# EasyEDA Pro project ProDoc_917_control_board_B.epro, board SiWG917 Control Board_B
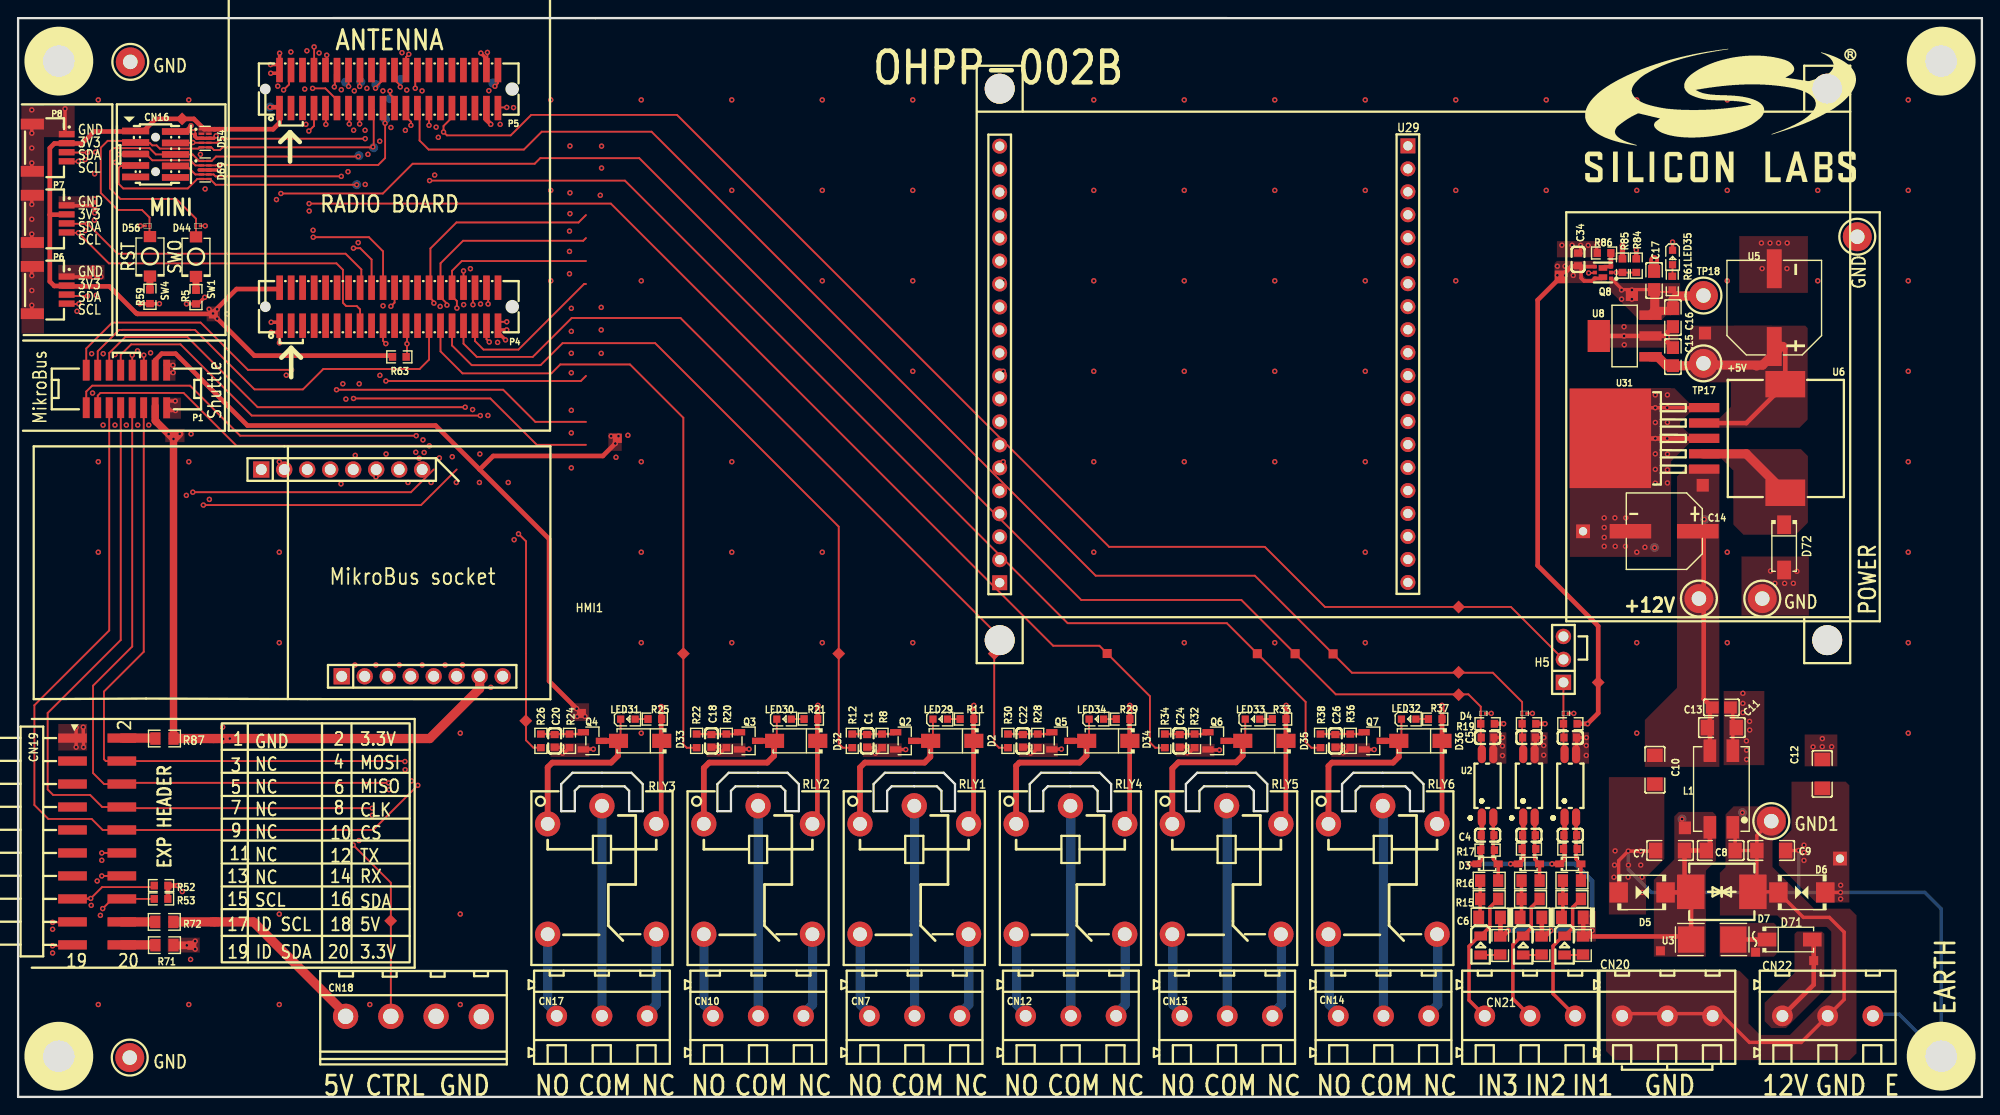
[diagram p8: board, top side]
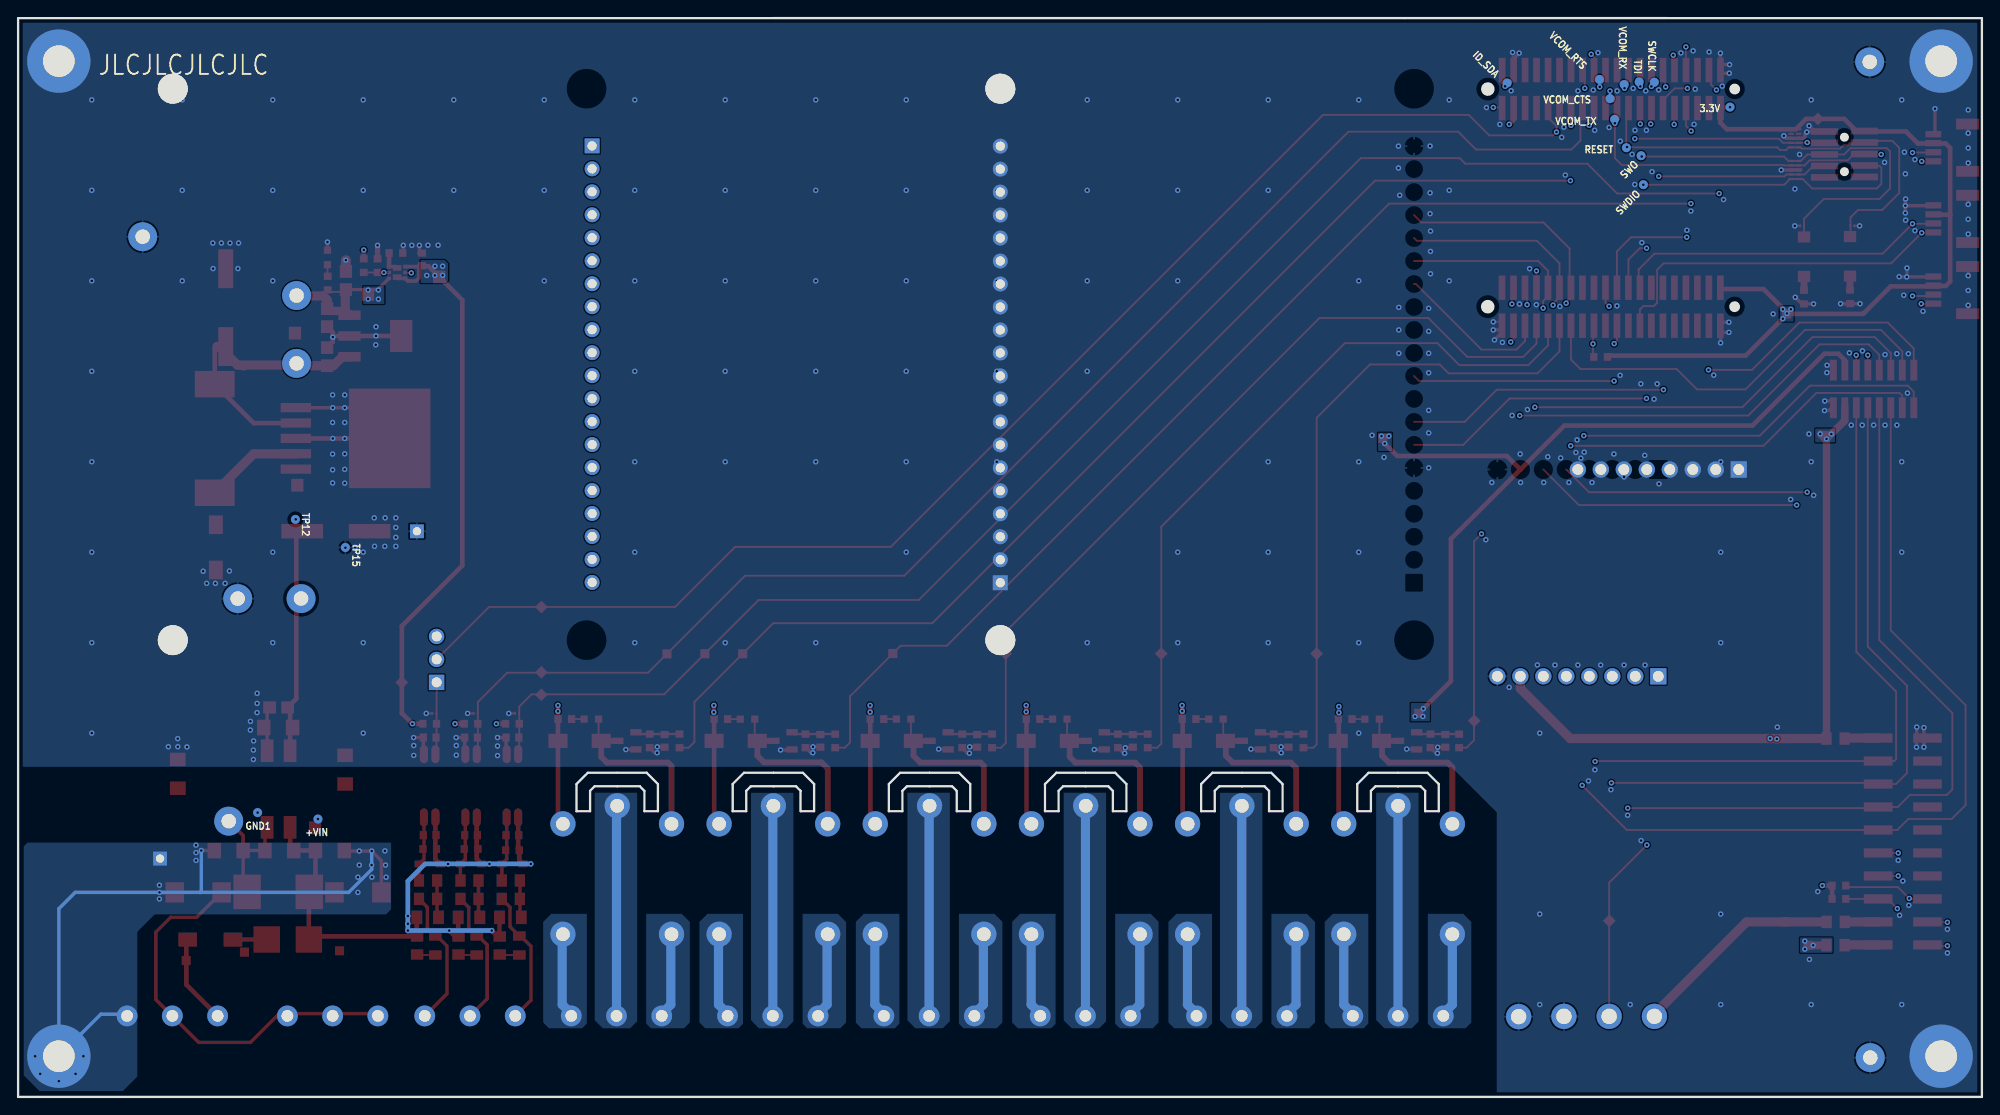
[diagram p9: board, bottom side, seen from below]

Outline 217 x 119.26 mm; copper layers: Top Layer, Inner1, Inner2, Bottom Layer. Coordinates in mm from the lower left corner of the outline.
Outline path: 0,119.25 63.82,119.26 217,119.25 217,0 0,0 0,119.25
Stack: Top Layer 0.035mm Outer layer thickness 1oz / Dielectric1 0.2104mm 7628 RC49% 8.6mil / Inner1 0.0152mm Inner layer thickness / Dielectric2 1.065mm 1.1mm H/HOZ Copper / Inner2 0.0152mm Inner layer thickness / Dielectric3 0.2104mm 7628 RC49% 8.6mil / Bottom Layer 0.035mm Outer layer thickness 1oz

## Design rules (mm)
template: Custom Config
spacing copperThickness1oz (default): track to track 0.203, other pairs 0.152 to 0.508
spacing Power: track to track 0.203, other pairs 0.102 to 0.305
spacing copperThicknessInner0.5oz: track to track 0.152, other pairs 0.152 to 0.3
track width Single50: min 0.356, default 0.356, max 0.356
track width SC50: min 0.203, default 0.203, max 0.203
track width AUTO (default): min 0.203, default 0.203, max 1.016
track width power: min 0.203, default 0.508, max 3.81
track width ForGND: min 0.203, default 0.381, max 1.27
differential pair differentialPair90 (default): width min 0.208, default 0.208, max 0.208; gap min 0.127, default 0.274
via viaSize (default): diameter min 0.599, default 0.599, max 0.599; hole min 0.3, default 0.3, max 0.3
net +3V3 uses Power, power
net GND uses ForGND, Power
net +12V_IN uses CR5V, Power, power
net PGND uses ForGND, Power
net +12DC_IN uses CR5V, Power, power
net +5V uses Power, power
net GND1 uses ForGND, Power
net +VIN uses Power, power
net +VIN1 uses Power, power
net +3V3_LDO uses Power, power
net $4N2550 uses CR5V

## Placement (name value [footprint] x y rotation side)
3.3V  -  [Test-Point-0.5mm]  27.83 109.42 270 bottom
+5V  -  [Test-Point-0.5mm]  192.1 80.79 0 top
+12V  RH-5120  [TESTPOINT-TH_BD3.2-D1.6-1]  185.73 55.09 270 top
+VIN  -  [Test-Point-0.5mm]  183.87 30.72 180 bottom
C1  1nF  [C0603]  93.82 39.36 90 top
C4  10nF  [C0603]  162.38 28.93 180 top
C5  100nF  [C0603]  162.38 39.73 180 top
C6  100nF  [CAP-SMD_L3.2-W1.6-FD]  162.6 19.84 180 top
C7  10nF  [C1206]  182.55 27.24 180 top
C8  10nF  [C1206]  188.13 27.24 180 top
C9  10nF  [C1206]  193.72 27.24 180 top
C10  10nF  [C1206]  180.87 36.17 270 top
C11  10nF  [C1206]  188.26 40.83 180 top
C12  10nF  [C1206]  199.36 35.71 90 top
C13  1uF  [C0805]  188.21 43.05 180 top
C14  100uF  [CAP-SMD_BD8.0-L8.3-W8.3-LS9.3-FD]  181.88 62.53 180 top
C15  22uF  [C0805]  182.86 81.83 270 top
C16  22uF  [C0805]  182.86 86.15 90 top
C17  22uF  [C0805]  180.78 90.25 270 top
C18  1nF  [C0603]  76.62 39.36 90 top
C20  1nF  [C0603]  59.29 39.36 90 top
C22  1nF  [C0603]  111.03 39.36 90 top
C24  1nF  [C0603]  128.36 39.36 90 top
C26  1nF  [C0603]  145.56 39.36 90 top
C28  10nF  [C0603]  166.95 28.93 180 top
C29  100nF  [C0603]  166.95 39.73 180 top
C30  100nF  [CAP-SMD_L3.2-W1.6-FD]  167.17 19.84 180 top
C31  10nF  [C0603]  171.52 28.93 180 top
C32  100nF  [C0603]  171.52 39.73 180 top
C33  100nF  [CAP-SMD_L3.2-W1.6-FD]  171.74 19.84 180 top
C34  1uF  [C0603]  172.37 92.58 270 top
CN7  WJ128V-5.0-3P  [CONN-TH_3P-P5.00_WJ128V-5.0-3P]  99.06 8.95 0 top
CN10  WJ128V-5.0-3P  [CONN-TH_3P-P5.00_WJ128V-5.0-3P]  81.79 8.95 0 top
CN12  WJ128V-5.0-3P  [CONN-TH_3P-P5.00_WJ128V-5.0-3P]  116.33 8.95 0 top
CN13  WJ128V-5.0-3P  [CONN-TH_3P-P5.00_WJ128V-5.0-3P]  133.6 8.95 0 top
CN14  WJ128V-5.0-3P  [CONN-TH_3P-P5.00_WJ128V-5.0-3P]  150.88 8.95 0 top
CN16  3132-10MG0BK00R2  [IDC-SMD_3132-10MG0BK00R2]  15.19 104.18 270 top
CN17  WJ128V-5.0-3P  [CONN-TH_3P-P5.00_WJ128V-5.0-3P]  64.52 8.95 0 top
CN18  WJ128V-5.0-4P  [CONN-TH_4P-P5.00_WJ128V-4P-5.0-14-00A]  43.69 8.89 0 top
CN19  PZ254-2-10-WS  [HDR-SMD_20P-P2.54-H-M-R2-C10_L8.5]  8.74 28.24 270 top
CN20  WJ128V-5.0-3P  [CONN-TH_3P-P5.00_WJ128V-5.0-3P]  182.25 8.95 0 top
CN21  WJ128V-5.0-3P  [CONN-TH_3P-P5.00_WJ128V-5.0-3P]  167.06 8.95 0 top
CN22  WJ128V-5.0-3P  [CONN-TH_3P-P5.00_WJ128V-5.0-3P]  199.96 8.95 0 top
D2  NRVA4007T3G  [SMA_L4.3-W2.6-LS5.2-FD]  103.22 39.36 0 top
D3  1N4148WS-7-F  [SOD-323_L1.8-W1.3-LS2.5-RD]  162.38 25.76 0 top
D4  TPD1E0B04DPLT  [X2SON-2_L0.6-W0.3-P0.35]  161.87 42.39 180 top
D5  SMBJ24CA-E3/5B  [SMB_L4.3-W3.6-LS5.4-BI]  179.45 22.61 180 top
D6  SMBJ24CA-E3/5B  [SMB_L4.3-W3.6-LS5.4-BI]  197.1 22.61 0 top
D7  SMCJ33CAHE3_A/H  [SMC_L6.9-W5.9-LS7.9-BI]  188.26 22.67 180 top
D32  NRVA4007T3G  [SMA_L4.3-W2.6-LS5.2-FD]  85.98 39.36 0 top
D33  NRVA4007T3G  [SMA_L4.3-W2.6-LS5.2-FD]  68.73 39.36 0 top
D34  NRVA4007T3G  [SMA_L4.3-W2.6-LS5.2-FD]  120.47 39.36 0 top
D35  NRVA4007T3G  [SMA_L4.3-W2.6-LS5.2-FD]  137.71 39.36 0 top
D36  NRVA4007T3G  [SMA_L4.3-W2.6-LS5.2-FD]  154.95 39.36 0 top
D37  1N4148WS-7-F  [SOD-323_L1.8-W1.3-LS2.5-RD]  166.95 25.76 0 top
D38  TPD1E0B04DPLT  [X2SON-2_L0.6-W0.3-P0.35]  166.44 42.39 180 top
D39  1N4148WS-7-F  [SOD-323_L1.8-W1.3-LS2.5-RD]  171.52 25.76 0 top
D40  TPD1E0B04DPLT  [X2SON-2_L0.6-W0.3-P0.35]  171.01 42.39 180 top
D44  TPD1E0B04DPLR  [TSSLP-2-3_L0.6-W0.3-P0.35-BI]  19.87 96.29 180 top
D54  TPD4E02B04DQAR  [USON-10_L2.5-W1.0-P0.50-BL]  20.67 105.97 270 top
D56  TPD1E0B04DPLR  [TSSLP-2-3_L0.6-W0.3-P0.35-BI]  14.31 96.29 0 top
D69  TPD4E02B04DQAR  [USON-10_L2.5-W1.0-P0.50-BL]  20.67 102.47 270 top
D71  SS54  [SMA_L4.4-W2.8-LS5.4-R-RD]  195.76 17.4 0 top
D72  SS54  [SMA_L4.4-W2.8-LS5.4-R-RD]  195.15 60.75 270 top
GND1  -  [Test-Point-0.5mm]  190.53 31.43 180 bottom
H1  -  [HOLE_D3M5_D7M0_PAD_PTH]  4.5 114.5 0 top
H2  -  [HOLE_D3M5_D7M0_PAD_PTH]  212.5 114.5 0 top
H3  -  [HOLE_D3M5_D7M0_PAD_PTH]  212.5 4.5 0 top
H4  -  [HOLE_D3M5_D7M0_PAD_PTH]  4.5 4.5 0 top
H5  PZ2.54-1*3  [HDR-TH_3P-P2.54-V-M]  170.76 48.36 90 top
HMI1  b193dabaa2f245388f572ebd17597501  [TFT_HXD8357]  108.47 80.97 90 top
ID_SDA  -  [Test-Point-0.5mm]  52.46 112.08 270 bottom
L1  744222  [FILTER-SMD_4P-L9.2-W6.0-TL-1]  188.21 34.04 90 top
LED29  KT-0603R  [LED0603-RD]  101.89 41.76 0 top
LED30  KT-0603R  [LED0603-RD]  84.64 41.76 0 top
LED31  KT-0603R  [LED0603-RD]  67.38 41.76 0 top
LED32  KT-0603R  [LED0603-RD]  153.66 41.76 0 top
LED33  KT-0603R  [LED0603-RD]  136.4 41.76 0 top
LED34  KT-0603R  [LED0603-RD]  119.15 41.76 0 top
LED35  KT-0603R  [LED0603-RD]  182.81 92.79 270 top
LED36  NCD0805R1  [LED0805-R-RD]  166.31 16.74 270 top
LED37  NCD0805R1  [LED0805-R-RD]  161.61 16.74 270 top
LED38  NCD0805R1  [LED0805-R-RD]  170.89 16.74 270 top
NOREF  -  [Pad_e9965]  73.51 49 45 top
NOREF#2  -  [Pad_e1970]  201.32 26.35 0 top
NOREF#3  -  [Pad_e9564]  191.99 16 0 top
NOREF#4  -  [Pad_e9983]  120.34 49.02 0 top
NOREF#5  -  [Pad_e2829]  21.61 39.61 0 top
NOREF#6  -  [Pad_e9977]  107.86 49 45 top
NOREF#7  -  [Pad_e2883]  21.57 86.55 0 top
NOREF#8  -  [Pad_e10001]  145.31 48.97 0 top
NOREF#9  -  [Pad_e2933]  19.2 16.76 0 top
NOREF#10  -  [Pad_e2835]  21.69 19.35 0 top
NOREF#11  -  [Pad_e2884]  17.17 73.12 0 top
NOREF#12  -  [Pad_e8746]  159.18 44.46 315 top
NOREF#13  -  [Pad_e8727]  186.4 84.43 270 top
NOREF#14  -  [Pad_e2849]  174.6 45.82 45 top
NOREF#15  -  [Pad_e8726]  178.33 88.7 270 top
NOREF#16  -  [Pad_e2826]  56.09 41.58 45 top
NOREF#17  -  [Pad_e8728]  186.15 67.61 270 top
NOREF#18  -  [Pad_e8734]  159.18 54.15 315 top
NOREF#19  -  [Pad_e8729]  184.18 29.74 270 top
NOREF#20  -  [Pad_e1969]  172.93 62.52 0 top
NOREF#21  -  [Pad_e2841]  41.17 19.46 135 top
NOREF#22  -  [Pad_e8740]  159.18 46.94 315 top
NOREF#23  -  [Pad_e9971]  90.68 49 45 top
NOREF#24  -  [Pad_e9556]  181.48 16.15 0 top
NOREF#25  -  [Pad_e9989]  136.94 48.99 0 top
NOREF#26  -  [Pad_e8720]  170.47 90.65 270 top
NOREF#27  -  [Pad_e9995]  141.11 48.99 0 top
NOREF#28  -  [Pad_e2934]  62.25 42.39 0 top
NOREF#29  -  [Pad_e2935]  66.21 72.8 0 top
NOREF#30  -  [Pad_e9558]  198.42 15.06 0 top
NOREF#31  -  [Pad_e2853]  18.12 108.12 45 top
P1  534b6cd0e4114285812f8339d66c30ad  [3221-16-0100-00_2]  11.97 78.26 180 top
P2  373094bc871c4079ac15742d1ee66422  [HDR-TH_8P-P2.54-V-F-1_3]  35.76 69.35 0 top
P3  e3853e2464dd4fd59feae40a415ed81a  [HDR-TH_8P-P2.54-V-F-1_2]  44.65 46.49 0 top
P4  3131-40MG0BK00T2  [CONN-SMD_40P-P1.27_WCON_3131-40MG0BK00T2_1]  40.96 87.35 180 top
P5  3131-40MG0BK00T2  [CONN-SMD_40P-P1.27_WCON_3131-40MG0BK00T2]  40.95 111.41 180 top
P6  HC-1.0-4PWT-B-HW  [CONN-SMD_4P-P1.00_HCTL_HC-1.0-4PWT]  3.47 89.19 270 top
P7  HC-1.0-4PWT-B-HW  [CONN-SMD_4P-P1.00_HCTL_HC-1.0-4PWT]  3.47 97.06 270 top
P8  HC-1.0-4PWT-B-HW  [CONN-SMD_4P-P1.00_HCTL_HC-1.0-4PWT]  3.47 104.93 270 top
Q2  AO3400A  [SOT-23-3_L2.9-W1.3-P1.90-LS2.4-BR]  97.97 39.36 180 top
Q3  AO3400A  [SOT-23-3_L2.9-W1.3-P1.90-LS2.4-BR]  80.72 39.36 180 top
Q4  AO3400A  [SOT-23-3_L2.9-W1.3-P1.90-LS2.4-BR]  63.46 39.36 180 top
Q5  AO3400A  [SOT-23-3_L2.9-W1.3-P1.90-LS2.4-BR]  115.22 39.36 180 top
Q6  AO3400A  [SOT-23-3_L2.9-W1.3-P1.90-LS2.4-BR]  132.48 39.36 180 top
Q7  AO3400A  [SOT-23-3_L2.9-W1.3-P1.90-LS2.4-BR]  149.73 39.36 180 top
Q8  SIA527DJ-T1-GE3  [POWERPAK-SC-70-6_L2.0-W2.0-P0.65-BL]  175.12 91.13 90 top
R5  120Ω  [R0603]  19.66 88.41 270 top
R8  10kΩ  [R0603]  95.47 39.36 90 top
R11  470Ω  [R0603]  104.85 41.77 0 top
R12  1kΩ  [R0603]  92.18 39.36 90 top
R15  1kΩ  [R0805]  162.55 21.88 180 top
R16  4.7kΩ  [R0805]  162.55 23.91 0 top
R17  100kΩ  [R0603]  162.38 27.28 180 top
R19  1kΩ  [R0603]  162.38 41.25 0 top
R20  10kΩ  [R0603]  78.26 39.36 90 top
R21  470Ω  [R0603]  87.6 41.77 0 top
R22  1kΩ  [R0603]  74.97 39.36 90 top
R24  10kΩ  [R0603]  60.93 39.36 90 top
R25  470Ω  [R0603]  70.36 41.77 0 top
R26  1kΩ  [R0603]  57.77 39.36 90 top
R28  10kΩ  [R0603]  112.67 39.36 90 top
R29  470Ω  [R0603]  122.1 41.77 0 top
R30  1kΩ  [R0603]  109.38 39.36 90 top
R32  10kΩ  [R0603]  130 39.36 90 top
R33  470Ω  [R0603]  139.34 41.77 0 top
R34  1kΩ  [R0603]  126.71 39.36 90 top
R36  10kΩ  [R0603]  147.2 39.36 90 top
R37  470Ω  [R0603]  156.59 41.77 0 top
R38  1kΩ  [R0603]  143.92 39.36 90 top
R40  1kΩ  [R0805]  167.13 21.88 180 top
R41  4.7kΩ  [R0805]  167.13 23.91 0 top
R42  100kΩ  [R0603]  166.95 27.41 180 top
R44  1kΩ  [R0603]  166.95 41.25 0 top
R45  1kΩ  [R0805]  171.7 21.88 180 top
R46  4.7kΩ  [R0805]  171.7 23.91 0 top
R47  100kΩ  [R0603]  171.52 27.41 180 top
R49  1kΩ  [R0603]  171.52 41.25 0 top
R52  3.3kΩ  [R0603]  15.8 23.36 0 top
R53  3.3kΩ  [R0603]  15.8 21.89 0 top
R59  120Ω  [R0603]  14.57 88.45 270 top
R61  330Ω  [R0603]  182.79 89.97 270 top
R63  1kΩ  [R0603]  42.13 81.8 180 top
R71  0Ω  [R0805]  16.17 16.77 0 top
R72  0Ω  [R0805]  16.16 19.35 0 top
R84  120Ω  [R0603]  178.81 91.89 270 top
R85  470kΩ  [R0603]  177.28 91.89 270 top
R86  470kΩ  [R0603]  175.25 93.29 0 top
R87  0Ω  [R0805]  16.17 39.61 0 top
R88  2.2kΩ  [R0805]  168.35 16.74 90 top
R89  2.2kΩ  [R0805]  163.77 16.74 90 top
R90  2.2kΩ  [R0805]  172.92 16.74 90 top
RESET  -  [Test-Point-0.5mm]  39.28 104.93 270 bottom
RLY1  SRD-05VDC-SL-C  [RELAY-TH_SRD-XXVDC-XL-C]  99.03 25.08 270 top
RLY2  SRD-05VDC-SL-C  [RELAY-TH_SRD-XXVDC-XL-C]  81.77 25.08 270 top
RLY3  SRD-05VDC-SL-C  [RELAY-TH_SRD-XXVDC-XL-C]  64.52 25.08 270 top
RLY4  SRD-05VDC-SL-C  [RELAY-TH_SRD-XXVDC-XL-C]  116.28 25.08 270 top
RLY5  SRD-05VDC-SL-C  [RELAY-TH_SRD-XXVDC-XL-C]  133.54 25.08 270 top
RLY6  SRD-05VDC-SL-C  [RELAY-TH_SRD-XXVDC-XL-C]  150.8 25.08 270 top
SW1  TS-1088-AR02016  [SW-SMD_L3.9-W3.0-P4.45]  19.66 92.89 270 top
SW4  TS-1088-AR02016  [SW-SMD_L3.9-W3.0-P4.45]  14.57 92.92 270 top
SWCLK  -  [Test-Point-0.5mm]  36.19 112.16 270 bottom
SWDIO  -  [Test-Point-0.5mm]  37.41 100.84 270 bottom
SWO  -  [Test-Point-0.5mm]  37.66 104.04 270 bottom
TDI  -  [Test-Point-0.5mm]  37.87 112.2 270 bottom
TP12  -  [Test-Point-0.5mm]  186.36 63.84 90 bottom
TP15  -  [Test-Point-0.5mm]  180.84 60.74 90 bottom
TP17  RH-5120  [TESTPOINT-TH_BD3.2-D1.6-1]  186.23 81.09 270 top
TP18  RH-5120  [TESTPOINT-TH_BD3.2-D1.6-1]  186.23 88.59 270 top
TP19  RH-5120  [TESTPOINT-TH_BD3.2-D1.6-1]  12.34 4.35 0 top
TP20  RH-5120  [TESTPOINT-TH_BD3.2-D1.6-1]  192.73 55.09 270 top
TP21  RH-5120  [TESTPOINT-TH_BD3.2-D1.6-1]  193.73 30.48 0 top
TP22  RH-5120  [TESTPOINT-TH_BD3.2-D1.6-1]  203.23 95.09 270 top
TP23  RH-5120  [TESTPOINT-TH_BD3.2-D1.6-1]  12.4 114.42 0 top
U2  LTV-217-B-G  [SOP-4_L4.4-W2.8-P1.27-LS7.0-BR]  162.38 34.39 270 top
U3  0454002.MR  [FUSE-SMD_L6.1-W2.6]  187.2 17.4 180 top
U5  1000uF  [CAP-SMD_BD10.0-L10.3-W10.3-LS11.3-FD-1]  194.06 87.25 90 top
U6  100uH  [IND-SMD_L13.5-W12.8]  195.27 72.78 270 top
U8  LM3940IMP-3.3/NOPB  [SOT-223_L6.5-W3.5-P2.30-LS7.0-BR]  177.52 84.11 0 top
U11  LTV-217-B-G  [SOP-4_L4.4-W2.8-P1.27-LS7.0-BR]  166.95 34.39 270 top
U12  LTV-217-B-G  [SOP-4_L4.4-W2.8-P1.27-LS7.0-BR]  171.52 34.39 270 top
U29  KH-2.54FH-1X20P-H8.5  [HDR-TH_20P-P2.54-V-F-2]  153.57 81 270 top
U31  LM2576-5.0WU  [TO-263-5_L10.1-W8.7-P1.70-LS15.2-BR]  181.13 72.8 0 top
VCOM_CTS  -  [Test-Point-0.5mm]  41.09 110.35 270 bottom
VCOM_RTS  -  [Test-Point-0.5mm]  42.25 112.47 270 bottom
VCOM_RX  -  [Test-Point-0.5mm]  39.53 111.91 270 bottom
VCOM_TX  -  [Test-Point-0.5mm]  40.59 108.06 270 bottom

## Footprints (pads in the part's own frame, mm; a bottom-side part is the same pattern mirrored in y, then rotated)
3221-16-0100-00_2
  rect 0.76x2.3 smd: 1(-4.445,-2.075) 2(-4.445,2.075) 3(-3.175,-2.075) 4(-3.175,2.075) 5(-1.905,-2.075) 6(-1.905,2.075) 7(-0.635,-2.075) 8(-0.635,2.075) 9(0.635,-2.075) 10(0.635,2.075) 11(1.905,-2.075) 12(1.905,2.075) 13(3.175,-2.075) 14(3.175,2.075) 15(4.445,-2.075) 16(4.445,2.075)
C0603
  rect 0.8x0.9 smd: 1(-0.7,0) 2(0.7,0)
C0805
  rect 1.41x1.35 smd: 1(-1,0) 2(1,0)
C1206
  rect 1.485x1.728 smd: 1(-1.593,0) 2(1.593,0)
CAP-SMD_BD8.0-L8.3-W8.3-LS9.3-FD
  rect 4.6x1.6 smd: 1(-3.724,0) 2(3.724,0)
CAP-SMD_BD10.0-L10.3-W10.3-LS11.3-FD-1
  rect 4.3x1.65 smd: 1(-4.3,0) 2(4.3,0)
CAP-SMD_L3.2-W1.6-FD
  rect 1.2x1.5 smd: 1(-1.2,0) 2(1.2,0)
CONN-SMD_4P-P1.00_HCTL_HC-1.0-4PWT
  rect 0.7x1.75 smd: 1(-1.5,1.895) 2(-0.5,1.895) 3(0.5,1.895) 4(1.5,1.895)
  rect 1.2x2.55 smd: 5(2.61,-1.895) 6(-2.61,-1.895)
CONN-SMD_40P-P1.27_WCON_3131-40MG0BK00T2
  rect 0.74x2.7 smd: 1(12.065,2.1) 2(12.065,-2.1) 3(10.795,2.1) 4(10.795,-2.1) 5(9.525,2.1) 6(9.525,-2.1) 7(8.255,2.1) 8(8.255,-2.1) 9(6.985,2.1) 10(6.985,-2.1) 11(5.715,2.1) 12(5.715,-2.1) 13(4.445,2.1) 14(4.445,-2.1) 15(3.175,2.1) 16(3.175,-2.1) 17(1.905,2.1) 18(1.905,-2.1) 19(0.635,2.1) 20(0.635,-2.1) 21(-0.635,2.1) 22(-0.635,-2.1) 23(-1.905,2.1) 24(-1.905,-2.1) 25(-3.175,2.1) 26(-3.175,-2.1) 27(-4.445,2.1) 28(-4.445,-2.1) 29(-5.715,2.1) 30(-5.715,-2.1) 31(-6.985,2.1) 32(-6.985,-2.1) 33(-8.255,2.1) 34(-8.255,-2.1) 35(-9.525,2.1) 36(-9.525,-2.1) 37(-10.795,2.1) 38(-10.795,-2.1) 39(-12.065,2.1) 40(-12.065,-2.1)
CONN-SMD_40P-P1.27_WCON_3131-40MG0BK00T2_1
  rect 0.74x2.7 smd: 1(12.065,2.1) 2(12.065,-2.1) 3(10.795,2.1) 4(10.795,-2.1) 5(9.525,2.1) 6(9.525,-2.1) 7(8.255,2.1) 8(8.255,-2.1) 9(6.985,2.1) 10(6.985,-2.1) 11(5.715,2.1) 12(5.715,-2.1) 13(4.445,2.1) 14(4.445,-2.1) 15(3.175,2.1) 16(3.175,-2.1) 17(1.905,2.1) 18(1.905,-2.1) 19(0.635,2.1) 20(0.635,-2.1) 21(-0.635,2.1) 22(-0.635,-2.1) 23(-1.905,2.1) 24(-1.905,-2.1) 25(-3.175,2.1) 26(-3.175,-2.1) 27(-4.445,2.1) 28(-4.445,-2.1) 29(-5.715,2.1) 30(-5.715,-2.1) 31(-6.985,2.1) 32(-6.985,-2.1) 33(-8.255,2.1) 34(-8.255,-2.1) 35(-9.525,2.1) 36(-9.525,-2.1) 37(-10.795,2.1) 38(-10.795,-2.1) 39(-12.065,2.1) 40(-12.065,-2.1)
CONN-TH_3P-P5.00_WJ128V-5.0-3P
  round 2.3 hole 1.3: 1(-5,0) 2(0.003,0) 3(5,0)
CONN-TH_4P-P5.00_WJ128V-4P-5.0-14-00A
  round 2.8 hole 1.7: 1(-7.5,0.015) 2(-2.5,0.015) 3(2.5,0.015) 4(7.5,-0.015)
FILTER-SMD_4P-L9.2-W6.0-TL-1
  rect 2.5x1.4 smd: 1(-4.237,1.27) 2(-4.237,-1.27) 3(4.237,-1.27) 4(4.237,1.27)
FUSE-SMD_L6.1-W2.6
  rect 2.91x2.91 smd: 1(-2.33,0) 2(2.33,0)
HDR-SMD_20P-P2.54-H-M-R2-C10_L8.5
  rect 1.02x3.17 smd: 1(-11.43,-2.725) 2(-11.43,2.725) 3(-8.89,-2.725) 4(-8.89,2.725) 5(-6.35,-2.725) 6(-6.35,2.725) 7(-3.81,-2.725) 8(-3.81,2.725) 9(-1.27,-2.725) 10(-1.27,2.725) 11(1.27,-2.725) 12(1.27,2.725) 13(3.81,-2.725) 14(3.81,2.725) 15(6.35,-2.725) 16(6.35,2.725) 17(8.89,-2.725) 18(8.89,2.725) 19(11.43,-2.725) 20(11.43,2.725)
HDR-TH_3P-P2.54-V-M
  rect 1.7x1.7 hole 1.1: 1(-2.54,0)
  round 1.7 hole 1.1: 2(0,0) 3(2.54,0)
HDR-TH_8P-P2.54-V-F-1_2
  rect 1.8x1.8 hole 1.2: 1(-8.89,0)
  round 1.8 hole 1.2: 2(-6.35,0) 3(-3.81,0) 4(-1.27,0) 5(1.27,0) 6(3.81,0) 7(6.35,0) 8(8.89,0)
HDR-TH_8P-P2.54-V-F-1_3
  rect 1.8x1.8 hole 1.2: 1(-8.89,0)
  round 1.8 hole 1.2: 2(-6.35,0) 3(-3.81,0) 4(-1.27,0) 5(1.27,0) 6(3.81,0) 7(6.35,0) 8(8.89,0)
HDR-TH_20P-P2.54-V-F-2
  rect 1.65x1.65 hole 1.02: 1(-24.13,0)
  round 1.65 hole 1.02: 2(-21.59,0) 3(-19.05,0) 4(-16.51,0) 5(-13.97,0) 6(-11.43,0) 7(-8.89,0) 8(-6.35,0) 9(-3.81,0) 10(-1.27,0) 11(1.27,0) 12(3.81,0) 13(6.35,0) 14(8.89,0) 15(11.43,0) 16(13.97,0) 17(16.51,0) 18(19.05,0) 19(21.59,0) 20(24.13,0)
HOLE_D3M5_D7M0_PAD_PTH
  round 7 hole 3.5: 1(0,0)
IDC-SMD_3132-10MG0BK00R2
  rect 0.74x3 smd: 1(-2.591,-2.203) 2(-2.54,2.203) 3(-1.321,-2.203) 4(-1.27,2.203) 6(0,2.203) 7(1.22,-2.203) 8(1.27,2.203) 9(2.49,-2.203) 10(2.54,2.203)
  rrect 0.74x3 smd: 5(-0.051,-2.203)
IND-SMD_L13.5-W12.8
  rect 2.924x4.4 smd: 1(6,0) 2(-6,0)
LED0603-RD
  rect 0.8x0.8 smd: 1(-0.799,0) 2(0.799,0)
LED0805-R-RD
  rect 1x1.399 smd: 1(1.05,0) 2(-1.05,0)
Pad_e1969
  rect 1.524x1.524 hole 0.914: 1(0,0)
Pad_e1970
  rect 1.524x1.524 hole 0.914: 1(0,0)
Pad_e2826
  rect 1x1 smd: 1(0,0)
Pad_e2829
  rect 1x1 smd: 1(0,0)
Pad_e2835
  rect 1x1 smd: 1(0,0)
Pad_e2841
  rect 1x1 smd: 1(0,0)
Pad_e2849
  rect 1x1 smd: 1(0,0)
Pad_e2853
  rect 1x1 smd: 1(0,0)
Pad_e2883
  rect 1x1 smd: 1(0,0)
Pad_e2884
  rect 1x1 smd: 1(0,0)
Pad_e2933
  rect 1x1 smd: 1(0,0)
Pad_e2934
  rect 1x1 smd: 1(0,0)
Pad_e2935
  rect 1x1 smd: 1(0,0)
Pad_e8720
  rect 1.41x1.35 smd: 1(0,0)
Pad_e8726
  rect 1.41x1.35 smd: 2(0,0)
Pad_e8727
  rect 1.41x1.35 smd: 3(0,0)
Pad_e8728
  rect 1.41x1.35 smd: 4(0,0)
Pad_e8729
  rect 1.41x1.35 smd: 5(0,0)
Pad_e8734
  rect 1x1 smd: 1(0,0)
Pad_e8740
  rect 1x1 smd: 2(0,0)
Pad_e8746
  rect 1x1 smd: 3(0,0)
Pad_e9556
  rect 1x1 smd: 1(0,0)
Pad_e9558
  rect 1x1 smd: 1(0,0)
Pad_e9564
  rect 1x1 smd: 2(0,0)
Pad_e9965
  rect 1x1 smd: 1(0,0)
Pad_e9971
  rect 1x1 smd: 2(0,0)
Pad_e9977
  rect 1x1 smd: 3(0,0)
Pad_e9983
  rect 1x1 smd: 4(0,0)
Pad_e9989
  rect 1x1 smd: 5(0,0)
Pad_e9995
  rect 1x1 smd: 6(0,0)
Pad_e10001
  rect 1x1 smd: 7(0,0)
POWERPAK-SC-70-6_L2.0-W2.0-P0.65-BL
  rect 0.4x0.46 smd: 1(-0.65,-0.9) 2(0,-0.9) 3(0.65,-0.9) 4(0.65,0.9) 5(0,0.9) 6(-0.65,0.9)
  rect 0.62x0.95 smd: 7(0.508,0) 8(-0.508,0)
R0603
  rect 0.806x0.864 smd: 1(-0.753,0) 2(0.753,0)
R0805
  rect 1.133x1.377 smd: 1(-1,0) 2(1,0)
RELAY-TH_SRD-XXVDC-XL-C
  round 2.794 hole 1.524: 1(-5.1,-6) 2(7.1,-6) 3(7.1,6) 4(-5.1,6) 5(-7.1,0)
SMA_L4.3-W2.6-LS5.2-FD
  rect 2.107x1.566 smd: 1(-2.386,0) 2(2.386,0)
SMA_L4.4-W2.8-LS5.4-R-RD
  rect 2.062x1.539 smd: 1(2.503,0) 2(-2.503,0)
SMB_L4.3-W3.6-LS5.4-BI
  rect 2.047x2.241 smd: 1(-2.591,0) 2(2.591,0)
SMC_L6.9-W5.9-LS7.9-BI
  rect 3.03x3.82 smd: 1(-3.435,0) 2(3.435,0)
SOD-323_L1.8-W1.3-LS2.5-RD
  rect 1x0.75 smd: 1(-1.173,0) 2(1.173,0)
SOP-4_L4.4-W2.8-P1.27-LS7.0-BR
  oval 2x0.9 smd: 1(3.5,-0.635) 2(3.5,0.635) 3(-3.5,0.635) 4(-3.5,-0.635)
SOT-23-3_L2.9-W1.3-P1.90-LS2.4-BR
  rect 1.25x0.7 smd: 1(1,-0.95) 2(1,0.95) 3(-1,0)
SOT-223_L6.5-W3.5-P2.30-LS7.0-BR
  rect 2.465x1.05 smd: 1(2.857,-2.3) 2(2.857,0) 3(2.857,2.3)
  rect 2.465x3.54 smd: 4(-2.857,0)
SW-SMD_L3.9-W3.0-P4.45
  rect 1.23x1.36 smd: 1(-2.185,0) 2(2.185,0)
Test-Point-0.5mm
  round 1 smd: 1(0,0)
TESTPOINT-TH_BD3.2-D1.6-1
  round 3.2 hole 1.6: 1(0,0)
TFT_HXD8357
  round 1.65 hole 1.02: 1(24.13,0) 2(21.59,0) 3(19.05,0) 4(16.51,0) 5(13.97,0) 6(11.43,0) 7(8.89,0) 8(6.35,0) 9(3.81,0) 10(1.27,0) 11(-1.27,0) 12(-3.81,0) 13(-6.35,0) 14(-8.89,0) 15(-11.43,0) 16(-13.97,0) 17(-16.51,0) 18(-19.05,0) 19(-21.59,0)
  rect 1.65x1.65 hole 1.02: 20(-24.13,0)
  round 3.302 hole 4.064: 21(30.48,0) 22(-30.48,0) 23(30.48,-91.44) 24(-30.48,-91.44)
TO-263-5_L10.1-W8.7-P1.70-LS15.2-BR
  rect 3.358x1.02 smd: 1(5.183,-3.4) 2(5.183,-1.7) 3(5.183,0) 4(5.183,1.7) 5(5.183,3.4)
  rect 9x11 smd: 6(-5.184,0)
TSSLP-2-3_L0.6-W0.3-P0.35-BI
  rect 0.21x0.32 smd: 1(-0.21,0) 2(0.21,0)
USON-10_L2.5-W1.0-P0.50-BL
  rect 0.25x0.609 smd: 1(-1,-0.414) 2(-0.5,-0.414) 4(0.5,-0.414) 5(1,-0.414) 6(1,0.414) 7(0.5,0.414) 9(-0.5,0.414) 10(-1,0.414)
  rect 0.38x0.609 smd: 3(0,-0.414) 8(0,0.414)
X2SON-2_L0.6-W0.3-P0.35
  rect 0.2x0.35 smd: 1(-0.225,0) 2(0.225,0)

## Nets
As in the schematic, except:
+3V3: 3.3V.1 C34.2 CN16.1 D54.1 D54.2 D54.9 D54.10 NOREF#5.1 NOREF#7.1 NOREF#11.1 NOREF#14.1 NOREF#26.1 NOREF#31.1 P1.4 P3.7 P4.2 P5.1 P6.2 P7.2 P8.2 Q8.4 Q8.6 Q8.8 R19.2 R44.2 R49.2 R52.2 R53.2 R63.2 R87.2
+3V3_LDO: C16.2 C17.2 NOREF#9.1 NOREF#15.2 Q8.1 R61.2 R71.2 TP18.1 U8.3
+5V: +5V.1 C15.2 CN18.1 D2.2 D32.2 D33.2 D34.2 D35.2 D36.2 HMI1.2 NOREF#10.1 NOREF#13.3 NOREF#28.1 NOREF#29.1 P1.3 P2.7 P5.37 R11.2 R21.2 R25.2 R29.2 R33.2 R37.2 R72.2 R84.1 RLY1.4 RLY2.4 RLY3.4 RLY4.4 RLY5.4 RLY6.4 TP17.1 U5.1 U6.2 U8.1 U31.4
+12V_IN: +VIN.1 C4.2 C6.1 C7.1 C8.2 C28.2 C30.1 C31.2 C33.1 D3.1 D5.1 D7.2 D37.1 D39.1 L1.1 NOREF#19.5 NOREF#24.1 R17.2 R42.2 R47.2 R88.2 R89.2 R90.2 U2.1 U3.2 U11.1 U12.1
+VIN: CN22.1 D71.1 NOREF#30.1
+VIN1: D71.2 NOREF#3.2 U3.1
GND: C1.1 C5.1 C11.1 C12.2 C13.1 C14.2 C15.1 C16.1 C17.1 C18.1 C20.1 C22.1 C24.1 C26.1 C29.1 C32.1 C34.1 CN16.2 CN18.3 CN18.4 CN19.1 D4.1 D38.1 D40.1 D44.1 D54.3 D54.8 D56.1 D69.3 D69.8 D72.1 H1.1 H2.1 H4.1 HMI1.1 HMI1.15 L1.3 LED35.1 NOREF#20.1 P1.1 P1.2 P2.8 P3.8 P4.1 P4.39 P5.2 P5.38 P6.1 P6.5 P6.6 P7.1 P7.5 P7.6 P8.1 P8.5 P8.6 Q2.2 Q3.2 Q4.2 Q5.2 Q6.2 Q7.2 R5.2 R8.1 R20.1 R24.1 R28.1 R32.1 R36.1 R59.2 R85.1 R86.1 TP15.1 TP19.1 TP20.1 TP22.1 TP23.1 U2.3 U5.2 U8.2 U8.4 U11.3 U12.3 U31.3 U31.5 U31.6
PGND: C7.2 C9.1 C10.2 C12.1 CN22.3 D5.2 D6.2 H3.1 NOREF#2.1
+12DC_IN: +12V.1 C10.1 C11.2 C13.2 C14.1 L1.4 NOREF#17.4 TP12.1 U31.1
RADIO_F12: C29.2 D38.2 NOREF#8.7 NOREF#22.2 P5.25 R44.1 U11.4
RADIO_F14: NOREF#25.5 P5.27 R38.1
RADIO_F18: H5.2 NOREF#18.1 P1.14 P5.31
RADIO_P26: NOREF.1 P4.29 R22.1
RADIO_P28: NOREF#23.2 P4.31 R12.1
RADIO_P30: NOREF#6.3 P4.33 R30.1
RADIO_P37: C5.2 D4.2 NOREF#12.3 NOREF#27.6 P5.4 R19.1 U2.4
RADIO_P40: NOREF#4.4 P5.7 R34.1
RADIO_P43: NOREF#16.1 P5.10 R26.1
RADIO_P44: CN18.2 NOREF#21.1 P5.11

Pads without a net: CN16 9 10; CN19 3 5 7 9 11 13; H5 3; HMI1 3 9 10 16 17 18 19 20 21 22 23 24; P4 3 4 5 6 7 8 9 10 11 12 13 14 17 21 24 25 26 40; P5 3 5 6 18 28 29 30 32 33 34 35 36; U29 1 2 3 4 5 6 7 8 9 10 11 12 13 14 15 16 17 18 19 20

## Via types
v1: diameter 0.599, hole 0.3, Top Layer to Bottom Layer, 335 vias
v2: diameter 0.6, hole 0.299, Top Layer to Bottom Layer, 81 vias
v3: diameter 0.6, hole 0.3, Top Layer to Bottom Layer, 100 vias

## Routing (per net, layer and track width the routed paths; a pad name or vN(x,y) marks a point on that pad's centre or on a via; arc(x,y) is an arc through that point)
+3V3: length 433.2
  Top Layer w0.406: 175.12,90.62 174.98,90.48 174.22,90.48 173.94,90.19 173.04,90.19 172.71,90.52 172.71,91.83 172.76,91.78 174.22,91.78
  Top Layer w0.508: 41.43,81.94 26.1,81.94 21.59,86.45 ; R44.2 v1(168.73,41.25) ; 3.51,97.51 3.51,90.14 4,89.65 4.91,89.65 4.96,89.6 10.07,89.6 13.04,86.64 13.1,86.64 13.19,86.55 21.39,86.55 24.14,89.3 28.9,89.3 ; 3.51,97.51 3.51,104.89 4.01,105.39 7.06,105.39 8.39,106.72 13.82,106.72 15.21,108.12 NOREF#31.1 19.41,108.12 20.56,106.97 D54.10 21.69,106.97 21.7,106.97 22.28,106.97 22.29,106.97 28.18,106.97 28.9,107.69 28.9,109.4 v1(27.84,109.4) ; 3.51,97.51 3.52,97.52 5.39,97.52 ; R49.2 v1(173.43,41.25) 174.6,42.42 NOREF#14.1 174.6,52.05 167.91,58.74 167.91,88.09 NOREF#26.1 171.65,91.83 172.71,91.83 ; R19.2 v1(164.15,41.25) ; 16.55,21.89 16.55,23.36 v1(17.63,23.36)
  Top Layer w0.813: R87.2 v1(17.17,72.74) ; v1(17.17,72.74) 17.3,72.74 v1(17.86,73.29) ; v1(17.17,72.74) v1(16.63,73.27) 15.29,74.61 15.29,74.62 15.15,74.76 15.15,76.35
  Top Layer w1.016: P3.7 51,45.14 45.48,39.61 v1(23.39,39.61) 22.61,39.61 ; 22.61,39.61 NOREF#5.1 R87.2 ; 22.61,39.61 v1(22.66,39.57)
  Inner2 w0.508: v1(22.66,39.57) 22.66,28.39 v1(17.63,23.36) ; v1(164.15,41.25) v1(168.73,41.25) v1(173.43,41.25) ; v1(21.54,86.61) 21.54,76.98 v1(17.86,73.29)
  Inner2 w1.524: 170.35,90.59 170.1,90.59 157.85,78.34 157.85,57.52 154.7,54.36 57.9,54.36 51,47.46 P3.7
  vias: v1(21.11,87.06) v1(22,87.06) v1(22,86.03) v2(170.09,91.83) v2(170.09,90.82) v2(170.94,91.83) v2(170.95,90.81) v2(171.84,90.81)
+3V3_LDO: length 218.7
  Top Layer w0.203: 182.81,88.99 181.03,88.99
  Top Layer w0.355: Q8.1 177.26,89.25 C17.2
  Top Layer w0.864: R71.2 17.19,16.76 v1(18.64,16.76)
  Top Layer w0.914: C16.2 182.59,86.88 180.85,86.88
  Top Layer w1.016: 180.85,89.17 180.85,86.88 180.38,86.42 ; C16.2 182.86,88.11 183.28,88.53 186.09,88.53 186.28,88.35 ; 180.78,89.2 180.81,89.2
  Inner2 w1.524: v1(18.64,16.76) 29.73,16.76 59.71,46.74 156.68,46.74 162.1,52.16 162.1,73.2 177.09,88.19 v1(177.19,88.19)
  vias: v1(19.57,17.22) v1(19.57,16.34) v1(177.19,89.2) v1(178.32,89.2) v1(178.32,88.19)
+5V: length 481.6
  Top Layer w0.508: 51.76,109.4 51.76,108 52.23,107.53 v1(52.23,107.51) ; 87.77,30.56 88.32,31.11 88.32,41.77 ; v1(140.12,43.28) v1(140.12,42.52) 140.12,41.79 R33.2 ; 51,69.35 46.14,74.21 25.35,74.21 17.4,82.16 15.87,82.16 15.15,81.44 15.15,80.3 ; 51,69.35 58.67,61.68 58.67,45.97 v1(61.72,42.92) ; 51,69.35 52.5,70.85 64.61,70.85 v1(65.99,72.23) ; R11.2 v1(105.6,42.57) v1(105.6,43.28) ; 105.03,30.56 105.58,31.11 105.58,41.77 ; 186.23,74.48 190.97,74.48 U6.2 195.27,82.71 195.02,82.96 ; 156.8,30.56 157.34,31.11 R37.2 v1(157.34,42.62) v1(157.34,43.28) ; 122.85,41.77 v1(122.85,42.54) v1(122.85,43.28) ; R21.2 v1(88.36,42.64) 88.36,43.26 v1(88.38,43.28) ; 71.06,41.77 71.06,31.11 70.52,30.56 ; R25.2 71.05,41.83 v1(71.05,42.48) v1(71.05,43.15) ; R84.1 v2(178.81,93.62) ; 122.28,30.56 122.83,31.11 122.83,41.77 ; 140.09,41.77 140.09,31.11 139.54,30.56
  Top Layer w1.016: R72.2 NOREF#10.1 26,19.35 36.19,9.16 ; 195.02,82.96 194.82,82.96 192.76,80.9 186.44,80.9 186.37,80.83 C15.2 182.17,80.83 181.18,81.81 U8.1
  Inner2 w0.508: 186.44,80.9 186.44,83.12 179.97,89.59 179.97,92.46 v2(178.81,93.62) ; v1(52.23,107.51) 57.18,102.56 62.88,102.56 65.99,99.45 v1(65.99,72.23)
  Inner2 w3.302: CN18.1 36.21,8.93 36.21,18.05 60.55,42.39 159.7,42.39 167.67,50.36 167.67,69.91 178.65,80.9 186.44,80.9
  vias: v1(61.77,42.05) v1(62.64,42.05) v1(65.53,73.04) v1(66.35,73.04)
+12V_IN: length 87.6
  Top Layer w0.508: L1.1 186.94,27.64 C8.2 C7.1 184.14,23.36 D7.2 ; v1(164.66,18.39) 164.01,17.74 R89.2 163.8,17.76 163.8,19.84 ; v1(169.49,25.76) D39.1 170.89,26.29 U12.1 ; D5.1 184.76,22.61 D7.2 ; v1(164.92,25.76) D37.1 166.31,26.29 U11.1 ; U2.1 161.74,27.4 R17.2 161.62,26.18 D3.1 v1(160.34,25.76) ; 173.28,17.74 184.53,17.74 U3.2 184.87,22.63 D7.2 ; 173.28,17.74 R90.2 172.94,17.76 172.94,19.84 ; 173.28,17.74 v1(173.93,18.39) ; v1(169.36,18.39) 168.71,17.74 R88.2 168.37,17.76 168.37,19.84
  Bottom Layer w0.508: v1(164.66,18.39) v1(169.36,18.39) v1(173.93,18.39) v1(173.93,19.14) v1(173.93,20) 173.93,23.85 172.03,25.76 v1(169.49,25.76) v1(164.92,25.76) v1(160.34,25.76)
  vias: v2(183.87,30.72)
+VIN: length 9.6
  Top Layer w0.508: 195.15,9.14 198.42,12.41 NOREF#30.1 198.42,17.4
+VIN1: length 3.9
  Top Layer w0.508: 193.4,17.4 U3.1
GND: length 125.9
  Top Layer w0.203: 53.03,85.4 53.31,85.68 v1(53.99,85.68) ; v1(51.86,115.46) 51.86,113.4 51.76,113.3
  Top Layer w0.229: D56.1 v1(13.52,96.29) ; D44.1 v1(20.68,96.29) ; D38.1 v1(167.33,42.39) ; D4.1 v1(162.78,42.39) ; D40.1 v1(171.9,42.39)
  Top Layer w0.381: v1(149.85,38.4) 148.75,38.4 Q7.2 ; 1.51,99.82 v1(1.51,98.66) ; 1.51,102.09 v1(1.51,103.24) ; v1(98.08,38.4) 96.98,38.4 96.97,38.41 ; R59.2 14.59,87.68 v1(15.62,87.68) ; 28.89,114.08 v1(28.89,115.37) ; v1(129.16,38.7) 128.35,38.7 128.3,38.66 ; v1(146.37,38.7) 145.6,38.7 C26.1 ; U12.3 172.22,37.96 C32.1 v1(173.3,39.73) ; v1(80.77,38.45) 79.75,38.45 79.71,38.41 ; 19.62,87.7 R5.2 v1(18.6,87.66) ; 51.66,114.3 51.66,114.85 v1(51.13,115.39) ; v1(132.75,38.35) 131.54,38.35 131.48,38.41 ; v1(9.14,90.67) 9.12,90.65 v1(8.31,90.65) ; 28.88,84.47 v1(28.88,83.35) ; v1(8.46,98.52) 8.46,99.23 v1(8.43,99.26) ; v1(8.46,98.52) 5.39,98.52 ; v1(8.46,98.52) v1(8.46,97.72) ; 18.47,106.72 CN16.2 ; 18.47,106.72 v1(19.1,107.36) ; 18.47,106.72 19.29,106.72 v1(19.35,106.65) 19.54,106.47 19.54,106.2 19.57,106.18 19.57,106.15 19.75,105.97 D54.3 20.83,105.97 ; 7.23,39.63 v1(7.23,38.66) ; v1(17.39,75.87) 16.9,75.87 16.42,76.35 ; v1(8.31,90.65) 8.31,90.73 8.28,90.75 v1(8.28,91.63) ; v1(8.31,90.65) 5.39,90.65 ; v1(53.86,83.68) 53.13,84.41 53.03,84.41 ; D54.8 21.61,105.97 v1(21.89,106.24) ; v1(53.99,84.79) 53.13,84.79 53.03,84.69 ; v1(63.57,38.45) 62.49,38.45 62.45,38.41 ; v1(164.03,39.73) C5.1 163.08,37.96 U2.3 ; 1.51,107.69 v1(1.51,106.53) ; 28.86,114.12 v1(27.89,114.12) ; 28.9,85.4 28.67,85.63 v1(27.97,85.63) ; 93.79,38.66 93.85,38.6 v1(94.65,38.6) ; 1.51,94.22 v1(1.51,95.38) ; v1(17.36,76.93) 16.65,76.93 16.48,76.75 16.48,76.35 ; 95.44,38.61 94.89,38.06 94.73,38.06 ; 146.39,38.06 146.66,38.06 147.2,38.61 ; 129.19,38.09 129.43,38.09 129.95,38.61 ; 77.42,38.06 77.64,38.06 78.18,38.61 ; 114.22,38.41 114.26,38.45 v1(115.28,38.45) ; 111.88,38.06 112.15,38.06 112.69,38.61 ; LED35.1 v2(182.81,94.5) ; 6.01,39.67 6.41,40.06 v1(6.41,40.83) ; R86.1 174.44,93.35 v2(174.44,94.13) ; 16.3,80.88 16.31,80.89 17.1,80.89 v1(17.11,80.88) ; 16.42,80.3 16.65,80.07 v1(17.14,80.07) ; 186.23,76.19 v2(182.23,76.19) 179.26,76.19 175.86,72.78 ; v2(172.66,94.13) 172.66,93.28 172.71,93.23 ; 60.92,38.61 60.38,38.06 60.16,38.06 ; 20,102.47 D69.8 v1(22.17,102.47) ; 5.39,106.39 5.19,106.6 v1(5.19,109.24) ; v1(111.86,38.7) 111.09,38.7 111.05,38.66 ; L1.3 189.48,42.78 C13.1 ; 59.28,38.66 59.29,38.65 v1(60.14,38.65) ; v1(20.62,88.39) 19.89,87.66 ; v1(13.47,87.68) 14.5,87.68 ; U11.3 167.65,37.96 C29.1 v1(168.6,39.73) ; v1(27.91,113.16) 28.75,113.16 28.9,113.3 ; 28.92,84.51 v1(27.95,84.51) ; 1.51,86.35 v1(1.51,87.51) ; 6.41,39.63 v1(6.41,38.66) ; 1.51,91.95 v1(1.51,90.78) ; v1(77.45,38.7) 76.58,38.7 76.53,38.66 ; 7.2,39.91 v1(7.2,40.88)
  Top Layer w0.508: 183.04,84.97 C16.1 182.22,84.51 v2(182.22,83.99) ; v2(182.22,83.99) 182.22,83.46 C15.1 ; v2(182.22,83.99) 182.1,84.11 U8.2 v2(177.46,84.11) U8.4 ; 186.23,72.78 v2(182.23,72.78) v2(180.91,72.78) 175.86,72.78
  Top Layer w0.584: R85.1 v2(177.28,94.13)
  Top Layer w1.092: C17.1 v2(180.78,92.5)
  vias: v1(1.51,109.1) v1(1.51,104.89) v1(1.51,97.02) v1(1.51,89.15) v1(3.81,18.53) v1(3.81,15.91) v1(6.51,86.85) v1(7.41,103.62) v1(7.41,95.77) v1(8.12,82.16) v1(8.08,21.18) v1(8.23,77.81) v1(8.43,96.92) v1(8.46,102.04) v1(8.56,104.44) v1(8.64,88.62) v1(8.74,23.87) v1(9.09,20.07) v1(9.25,26.16) v1(9.4,82.16) v1(9.39,74.26) v1(10.71,82.06) v1(10.71,74.26) v1(10.76,103.31) v1(11.96,74.26) v1(13.2,82.47) v1(13.22,74.26) v1(14.44,74.26) v1(14.64,82.25) v1(18.14,22.7) v1(18.59,66.49) v1(19.11,73.29) v1(19.06,15.2) v1(20.15,104.18) v1(20.67,100.37) v1(21.13,66.05) v1(22.6,40.88) v1(23.07,86.55) v1(28.55,99.19) v1(28.69,111.73) v1(29.64,79.78) v1(30.14,115.51) v1(31.67,111.4) v1(31.8,107.51) v1(31.91,115.64) v1(32.17,97.93) v1(32.6,95.8) v1(33.26,115.4) v1(35.72,111.33) v1(35.68,67.77) v1(35.88,78.83) v1(36.22,77.14) v1(36.46,102.28) v1(37.15,111.21) v1(37.07,106.86) v1(37.23,47.74) v1(37.26,70.92) v1(37.58,94.44) v1(37.69,78.83) v1(37.66,28.34) v1(38.34,106.86) v1(38.36,100.86) v1(38.54,111.49) v1(38.66,104.19) v1(39.15,31.14) v1(39.54,68.53) v1(39.54,47.74) v1(39.96,105.64) v1(39.98,79.76) v1(40.31,111.21) v1(40.32,87.45) v1(40.66,71.07) v1(41,33.96) v1(41.2,107.16) v1(42.13,47.74) v1(42.42,115.43) v1(42.79,106.85) v1(42.77,36.17) v1(42.94,111.3) v1(43.08,67.92) v1(43.47,34.93) v1(43.94,71.26) v1(44.32,70.6) v1(44.64,111.21) v1(44.74,72.63) v1(44.65,47.74) v1(44.87,71.24) v1(45.64,67.92) v1(46.03,101.9) v1(46.19,107.2) v1(46.43,106.07) v1(46.64,87.38) v1(46.55,70.63) v1(47.18,47.74) v1(47.97,70.76) v1(48.42,67.92) v1(49.11,47.75) v1(49.23,87.57) v1(49.98,91.56) v1(50.22,75.98) v1(51.02,71.07) v1(50.98,67.92) v1(51.1,87.65) v1(51.92,75.33) v1(52.02,111.23) v1(52.23,45.27) v1(52.98,83.41) v1(53.27,107.51) v1(54.16,67.92) v1(54.75,109.36) v1(54.81,61.59) v1(60.16,37.99) v1(60.93,95.71) v1(60.93,93.46) v1(60.93,90.99) v1(60.98,105.11) v1(60.98,99.94) v1(60.98,97.64) v1(61.13,87.17) v1(61.13,84.63) v1(61.13,82.2) v1(61.13,80.05) v1(61.13,75.9) v1(61.13,73.4) v1(61.13,69.54) v1(64.33,99.67) v1(64.43,87.27) v1(64.43,84.78) v1(64.43,82.19) v1(64.47,105.1) v1(64.47,102.68) v1(66.07,70.7) v1(67.38,73.13) v1(77.42,38.04) v1(94.73,37.99) v1(111.88,37.99) v1(129.19,38.04) v1(146.39,38.04) v1(164.02,38.79) v1(164.02,37.73) v1(168.58,38.84) v1(168.58,37.78) v1(170.59,94.15) v1(171.72,94.15) v1(173.28,38.84) v1(173.28,37.75) v1(173.5,94.13) v1(192.71,91.57) v1(194.13,56.77) v1(195.2,56.77) v1(195.46,91.57) v1(196.17,56.77) v1(196.55,58.1) v2(175.26,64.01) v2(175.27,62.94) v2(175.27,61.85) v2(175.26,60.86) v2(176.45,64.01) v2(176.49,60.86) v2(177.46,85.13) v2(177.48,83.14) v2(177.65,64.01) v2(177.61,60.86) v2(179.76,60.76) v2(180.83,60.71) v2(180.91,77.6) v2(180.91,76.19) v2(180.91,74.55) v2(180.91,71.09) v2(180.91,69.37) v2(180.91,67.84) v2(182.25,77.6) v2(182.25,74.55) v2(182.25,71.06) v2(182.25,69.33) v2(182.25,67.87) v2(190.59,44.61) v2(190.59,43.5) v2(190.6,42.48) v2(190.98,39.35) v2(191,38.34) v2(191,37.3) v2(191.32,41.51) v2(191.34,40.56) v2(192.64,94.39) v2(193.59,94.39) v2(194.53,94.39) v2(195.48,94.39) v2(198.34,38.69) v2(199.36,38.71) v2(200.39,38.71) v3(8.86,110.21) v3(8.86,70.21) v3(8.86,60.21) v3(8.86,10.21) v3(18.86,110.21) v3(18.86,70.21) v3(18.86,10.21) v3(28.86,70.21) v3(28.86,60.21) v3(28.86,50.21) v3(28.86,20.21) v3(28.86,10.21) v3(38.86,10.21) v3(48.86,40.21) v3(48.86,20.21) v3(48.86,10.21) v3(58.86,110.21) v3(58.86,100.21) v3(58.86,90.21) v3(68.86,110.21) v3(68.86,90.21) v3(68.86,70.21) v3(68.86,60.21) v3(68.86,50.21) v3(68.86,40.21) v3(78.86,110.21) v3(78.86,100.21) v3(78.86,70.21) v3(78.86,60.21) v3(78.86,50.21) v3(88.86,110.21) v3(88.86,100.21) v3(88.86,90.21) v3(88.86,60.21) v3(88.86,50.21) v3(98.86,110.21) v3(98.86,100.21) v3(98.86,90.21) v3(98.86,80.21) v3(98.86,50.21) v3(108.86,110.21) v3(108.86,100.21) v3(108.86,90.21) v3(108.86,80.21) v3(108.86,70.21) v3(108.86,50.21) v3(118.86,110.21) v3(118.86,100.21) v3(118.86,90.21) v3(118.86,80.21) v3(118.86,70.21) v3(118.86,60.21) v3(128.86,110.21) v3(128.86,100.21) v3(128.86,90.21) v3(128.86,80.21) v3(128.86,70.21) v3(128.86,50.21) v3(138.86,110.21) v3(138.86,100.21) v3(138.86,90.21) v3(138.86,80.21) v3(138.86,70.21) v3(138.86,50.21) v3(148.86,110.21) v3(148.86,100.21) v3(148.86,90.21) v3(148.86,80.21) v3(148.86,70.21) v3(148.86,60.21) v3(148.86,50.21) v3(158.86,110.21) v3(158.86,100.21) v3(158.86,90.21) v3(168.86,110.21) v3(168.86,100.21) v3(178.86,110.21) v3(178.86,100.21) v3(178.86,60.21) v3(178.86,50.21) v3(178.86,40.21) v3(188.86,110.21) v3(188.86,100.21) v3(188.86,90.21) v3(188.86,60.21) v3(188.86,50.21) v3(193.65,58.14) v3(198.86,110.21) v3(198.86,100.21) v3(198.86,90.21) v3(198.86,50.21) v3(199.37,39.61) v3(208.86,110.21) v3(208.86,100.21) v3(208.86,90.21) v3(208.86,80.21) v3(208.86,70.21) v3(208.86,60.21) v3(208.86,50.21) v3(208.86,40.21)
